# Altium schematic sheet MR_Mcu.SchDoc
size A4; CompanyName: BeeIonic; SheetNumber: 4; SheetTotal: 7
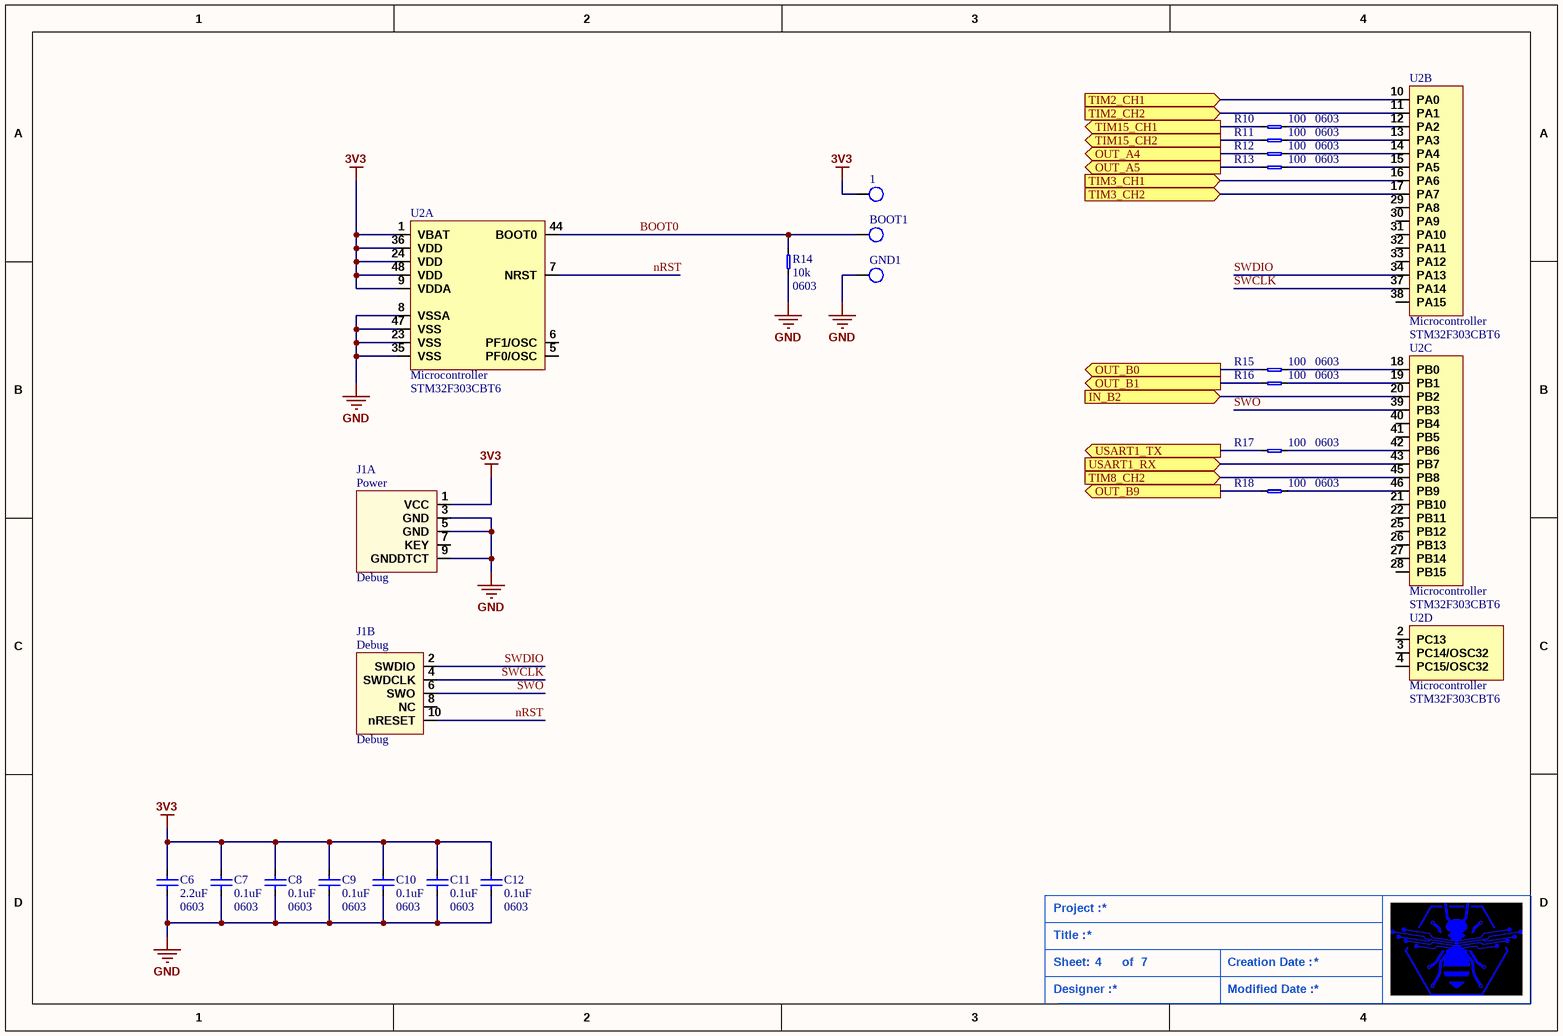
[diagram p0: MR_Mcu.SchDoc]

## Parts
1  TestPoint  [ROUND_TEST_POINT]  (value not drawn)  (no BOM)
BOOT1  TestPoint  [ROUND_TEST_POINT]  (value not drawn)  (no BOM)
C6  value 2.2uF  Package: 0603  [0603_CAP_LD]  (hidden comment: CerCap)
C7  value 0.1uF  Package: 0603  [0603_CAP_LD]  (hidden comment: CerCap)
C8  value 0.1uF  Package: 0603  [0603_CAP_LD]  (hidden comment: CerCap)
C9  value 0.1uF  Package: 0603  [0603_CAP_LD]  (hidden comment: CerCap)
C10  value 0.1uF  Package: 0603  [0603_CAP_LD]  (hidden comment: CerCap)
C11  value 0.1uF  Package: 0603  [0603_CAP_LD]  (hidden comment: CerCap)
C12  value 0.1uF  Package: 0603  [0603_CAP_LD]  (hidden comment: CerCap)
GND1  TestPoint  [ROUND_TEST_POINT]  (value not drawn)  (no BOM)
J1  Debug  [62201021121]  (parts A,B of 2)
R10  value 100  Package: 0603  [0603_RES_LD]  (hidden comment: Resistor)
R11  value 100  Package: 0603  [0603_RES_LD]  (hidden comment: Resistor)
R12  value 100  Package: 0603  [0603_RES_LD]  (hidden comment: Resistor)
R13  value 100  Package: 0603  [0603_RES_LD]  (hidden comment: Resistor)
R14  value 10k  Package: 0603  [0603_RES_LD]  (hidden comment: Resistor)
R15  value 100  Package: 0603  [0603_RES_LD]  (hidden comment: Resistor)
R16  value 100  Package: 0603  [0603_RES_LD]  (hidden comment: Resistor)
R17  value 100  Package: 0603  [0603_RES_LD]  (hidden comment: Resistor)
R18  value 100  Package: 0603  [0603_RES_LD]  (hidden comment: Resistor)
U2  Microcontroller  [STM32_LQFP48]  (parts A,B,C,D of 4)

## Ports
IN_B2 (in), OUT_A4 (out), OUT_A5 (out), OUT_B0 (out), OUT_B1 (out), OUT_B9 (out), TIM2_CH1 (in), TIM2_CH2 (in), TIM3_CH1 (in), TIM3_CH2 (in), TIM8_CH2 (in), TIM15_CH1 (out), TIM15_CH2 (out), USART1_RX (in), USART1_TX (out)

## Nets
3V3: 1.1(TP) C6.2 C7.2 C8.2 C9.2 C10.2 C11.2 C12.2 J1.1(VCC) U2.1(VBAT) U2.9(VDDA) U2.24(VDD) U2.36(VDD) U2.48(VDD)
GND: C6.1 C7.1 C8.1 C9.1 C10.1 C11.1 C12.1 GND1.1(TP) J1.3(GND) J1.5(GND) J1.9(GNDDTCT) R14.1 U2.8(VSSA) U2.23(VSS) U2.35(VSS) U2.47(VSS)
BOOT0: BOOT1.1(TP) R14.2 U2.44(BOOT0)
IN_B2: U2.20(PB2) ; port IN_B2
nRST: J1.10(nRESET) U2.7(NRST)
OUT_A4: R12.1 ; port OUT_A4
OUT_A5: R13.1 ; port OUT_A5
OUT_B0: R15.1 ; port OUT_B0
OUT_B1: R16.1 ; port OUT_B1
OUT_B9: R18.1 ; port OUT_B9
SWCLK: J1.4(SWDCLK) U2.37(PA14)
SWDIO: J1.2(SWDIO) U2.34(PA13)
SWO: J1.6(SWO) U2.39(PB3)
TIM2_CH1: U2.10(PA0) ; port TIM2_CH1
TIM2_CH2: U2.11(PA1) ; port TIM2_CH2
TIM3_CH1: U2.16(PA6) ; port TIM3_CH1
TIM3_CH2: U2.17(PA7) ; port TIM3_CH2
TIM8_CH2: U2.45(PB8) ; port TIM8_CH2
TIM15_CH1: R10.1 ; port TIM15_CH1
TIM15_CH2: R11.1 ; port TIM15_CH2
USART1_RX: U2.43(PB7) ; port USART1_RX
USART1_TX: R17.1 ; port USART1_TX
NetR10_2: R10.2 U2.12(PA2)
NetR11_2: R11.2 U2.13(PA3)
NetR12_2: R12.2 U2.14(PA4)
NetR13_2: R13.2 U2.15(PA5)
NetR15_2: R15.2 U2.18(PB0)
NetR16_2: R16.2 U2.19(PB1)
NetR17_2: R17.2 U2.42(PB6)
NetR18_2: R18.2 U2.46(PB9)

Not connected (* = marked no-connect by the designer): J1 7(KEY) 8(NC); U2 2(PC13) 3(PC14/OSC32) 4(PC15/OSC32) 5(PF0/OSC) 6(PF1/OSC) 21(PB10) 22(PB11) 25(PB12) 26(PB13) 27(PB14) 28(PB15) 29(PA8) 30(PA9) 31(PA10) 32(PA11) 33(PA12) 38(PA15) 40(PB4) 41(PB5)

## Notes on the sheet
- Project :
- Title :
- Sheet:
- of
- Creation Date :
- Designer :
- Modified Date :
- (in symbol Cortex_10x2, part A) Power

## Library data of the parts
C6-C12 = CerCap: Ceramic Capacitor; Type: *; Voltage/Power: *
J1 = Cortex_10x2: Cortex 10 pins Debug Connector
U2 = STM32F303CBT6: STM32F303 Microcontroller; Reference: STM32F303CBT6
R10-R18 = Resistor: Precision: *